# Altium schematic sheet Sheet2.SchDoc
size E; SheetNumber: 2; SheetTotal: 2
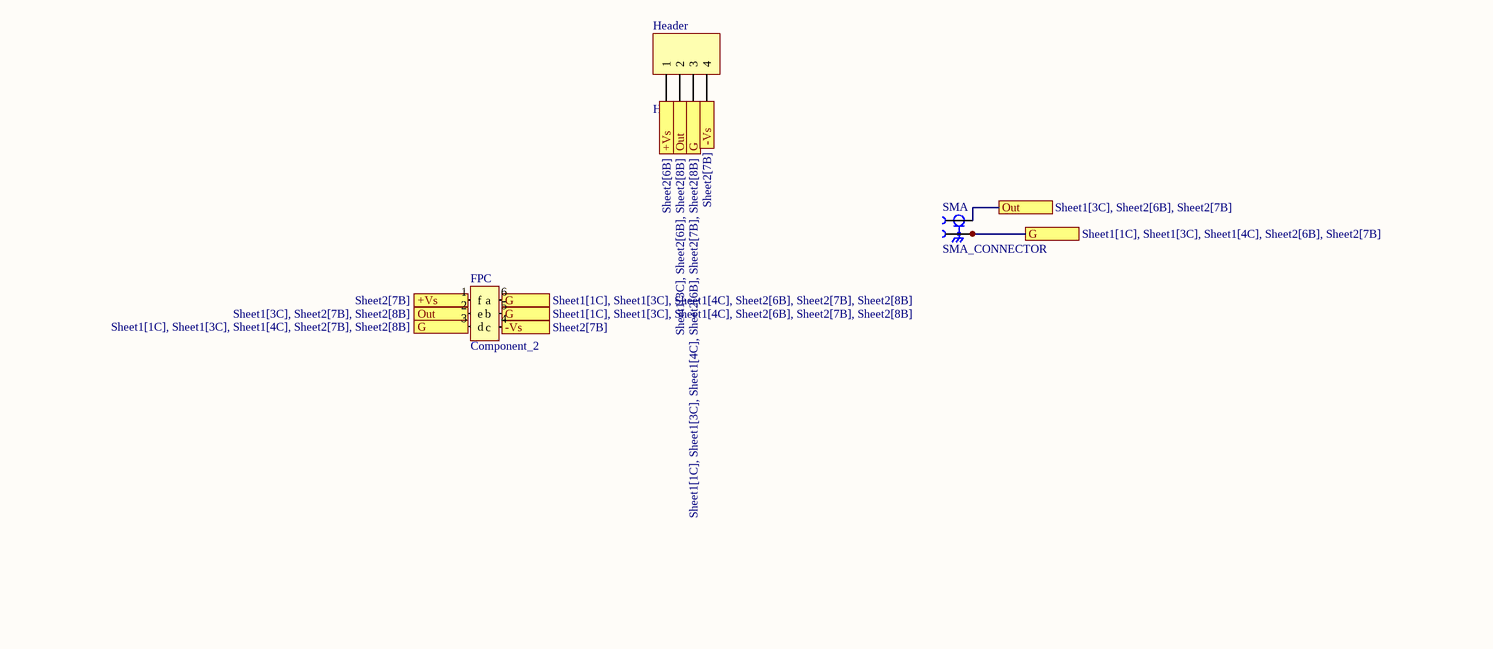
[diagram p0: Sheet2.SchDoc]

## Parts
FPC  Component_2  [PCBComponent_1]
Header  Header 4  [HDR1X4]
SMA  SMA_CONNECTOR  [LPRS_SMA_CONNECTOR]

## Ports
+Vs (see Sheet2[6B]), +Vs (see Sheet2[7B]), -Vs (see Sheet2[7B]), G (see Sheet1[1C], Sheet1[3C], Sheet1[4C], Sheet2[6B], Sheet2[7B]), G (see Sheet1[1C], Sheet1[3C], Sheet1[4C], Sheet2[6B], Sheet2[7B], Sheet2[8B]), G (see Sheet1[1C], Sheet1[3C], Sheet1[4C], Sheet2[7B], Sheet2[8B]), Out (see Sheet1[3C], Sheet2[6B], Sheet2[7B]), Out (see Sheet1[3C], Sheet2[6B], Sheet2[8B]), Out (see Sheet1[3C], Sheet2[7B], Sheet2[8B])

## Nets
+Vs: FPC.1(f) Header.1 ; port +Vs
-Vs: FPC.4(c) Header.4 ; port -Vs
G: FPC.3(d) FPC.5(b) FPC.6(a) Header.3 SMA.G1 SMA.G2 SMA.G3 SMA.G4 ; port G
Out: FPC.2(e) Header.2 SMA.1 ; port Out

## Library data of the parts
Header = Header 4: Header, 4-Pin; LatestRevisionDate: 17-Jul-2002; LatestRevisionNote: Re-released for DXP Platform.; Publisher: Altium Limited
SMA = SMA_CONNECTOR: Straight SMA Connector; MP: altium_native_batch; Value: *; Package: None; Availability: Unavailable; Price: None